# Altium schematic sheet Sh2_MCU.SchDoc
size A3
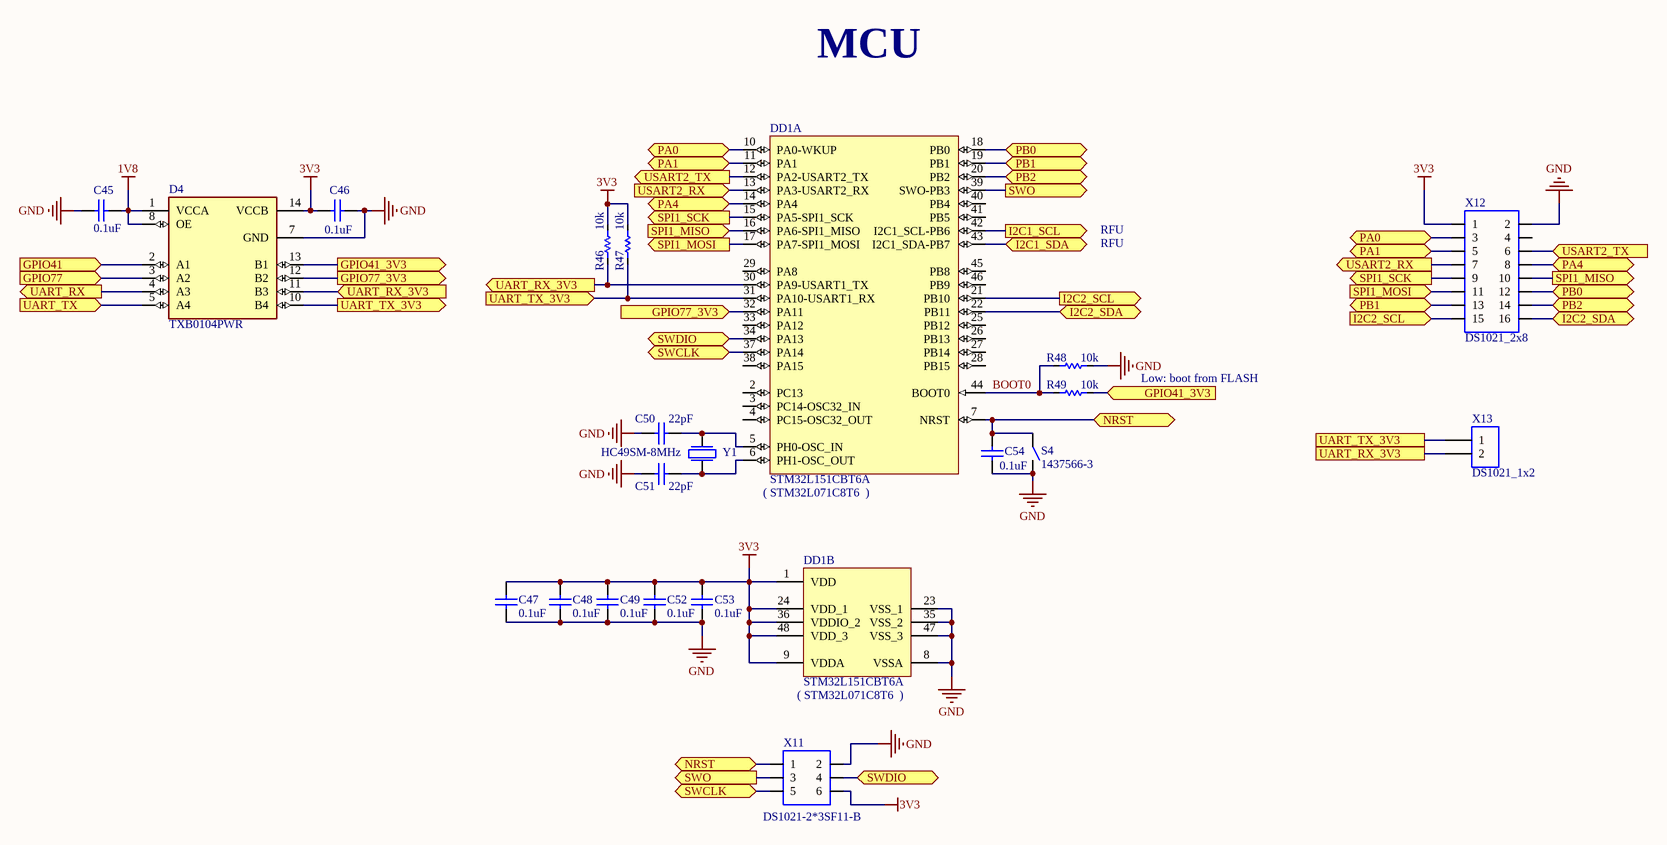
[diagram p0: Sh2_MCU.SchDoc]

## Parts
C45  0.1uF  [C_SMD0603]
C46  0.1uF  [C_SMD0603]
C47  0.1uF  [C_SMD0603]
C48  0.1uF  [C_SMD0603]
C49  0.1uF  [C_SMD0603]
C50  22pF  [C_SMD0603]
C51  22pF  [C_SMD0603]
C52  0.1uF  [C_SMD0603]
C53  0.1uF  [C_SMD0603]
C54  0.1uF  [C_SMD0603]
D4  TXB0104PWR  [SOP65P640X120-14N]
DD1  STM32L151CBT6A  [LQFP48_N]  (parts A,B of 2)
R46  10k  [R_SMD0603]
R47  10k  [R_SMD0603]
R48  10k  [R_SMD0603]
R49  10k  [R_SMD0603]
S4  1437566-3  [1437566-3]
X11  DS1021-2*3SF11-B  [PLD2-3]
X12  DS1021_2x8  [PLD2X8]
X13  DS1021_1x2  [PLD2]
Y1  HC49SM-8MHz  [HC49SM]

## Ports
GPIO41 (in), GPIO41_3V3 (in), GPIO41_3V3 (out), GPIO77 (in), GPIO77_3V3 (in), GPIO77_3V3 (out), I2C1_SCL (out), I2C1_SDA (bidir), I2C2_SCL (in), I2C2_SCL (out), I2C2_SDA (bidir), NRST (bidir), PA0 (bidir), PA1 (bidir), PA4 (bidir), PB0 (bidir), PB1 (bidir), PB2 (bidir), SPI1_MISO (in), SPI1_MISO (out), SPI1_MOSI (in), SPI1_MOSI (out), SPI1_SCK (out), SWCLK (bidir), SWDIO (bidir), SWO (out), UART_RX (out), UART_RX_3V3, UART_RX_3V3 (in), UART_RX_3V3 (out), UART_TX (in), UART_TX_3V3, UART_TX_3V3 (in), UART_TX_3V3 (out), USART2_RX (in), USART2_RX (out), USART2_TX (in), USART2_TX (out)

## Nets
1V8: C45.1 D4.1(VCCA) D4.8(OE)
3V3: C46.2 C47.1 C48.1 C49.1 C52.1 C53.1 D4.14(VCCB) DD1.1(VDD) DD1.9(VDDA) DD1.24(VDD_1) DD1.36(VDDIO_2) DD1.48(VDD_3) R46.1(CCW) R47.1(CCW) X11.6 X12.1
GND: C45.2 C46.1 C47.2 C48.2 C49.2 C50.1 C51.1 C52.2 C53.2 C54.2 D4.7(GND) DD1.8(VSSA) DD1.23(VSS_1) DD1.35(VSS_2) DD1.47(VSS_3) R48.2(CW) S4.2 X11.2 X12.2
BOOT0: DD1.44(BOOT0) R48.1(CCW) R49.1(CCW)
GPIO41: D4.2(A1) ; port GPIO41
GPIO41_3V3: D4.13(B1) R49.2(CW) ; port GPIO41_3V3
GPIO77: D4.3(A2) ; port GPIO77
GPIO77_3V3: D4.12(B2) DD1.32(PA11) ; port GPIO77_3V3
I2C1_SCL: DD1.42(I2C1_SCL-PB6) ; port I2C1_SCL
I2C1_SDA: DD1.43(I2C1_SDA-PB7) ; port I2C1_SDA
I2C2_SCL: DD1.21(PB10) X12.15 ; port I2C2_SCL
I2C2_SDA: DD1.22(PB11) X12.16 ; port I2C2_SDA
NRST: C54.1 DD1.7(NRST) S4.1 X11.1 ; port NRST
PA0: DD1.10(PA0-WKUP) X12.3 ; port PA0
PA1: DD1.11(PA1) X12.5 ; port PA1
PA4: DD1.14(PA4) X12.8 ; port PA4
PB0: DD1.18(PB0) X12.12 ; port PB0
PB1: DD1.19(PB1) X12.13 ; port PB1
PB2: DD1.20(PB2) X12.14 ; port PB2
SPI1_MISO: DD1.16(PA6-SPI1_MISO) X12.10 ; port SPI1_MISO
SPI1_MOSI: DD1.17(PA7-SPI1_MOSI) X12.11 ; port SPI1_MOSI
SPI1_SCK: DD1.15(PA5-SPI1_SCK) X12.9 ; port SPI1_SCK
SWCLK: DD1.37(PA14) X11.5 ; port SWCLK
SWDIO: DD1.34(PA13) X11.4 ; port SWDIO
SWO: DD1.39(SWO-PB3) X11.3 ; port SWO
UART_RX: D4.4(A3) ; port UART_RX
UART_RX_3V3: D4.11(B3) DD1.30(PA9-USART1_TX) R46.2(CW) X13.2 ; port UART_RX_3V3
UART_TX: D4.5(A4) ; port UART_TX
UART_TX_3V3: D4.10(B4) DD1.31(PA10-USART1_RX) R47.2(CW) X13.1 ; port UART_TX_3V3
USART2_RX: DD1.13(PA3-USART2_RX) X12.7 ; port USART2_RX
USART2_TX: DD1.12(PA2-USART2_TX) X12.6 ; port USART2_TX
NetC50_2: C50.2 DD1.5(PH0-OSC_IN) Y1.2
NetC51_2: C51.2 DD1.6(PH1-OSC_OUT) Y1.1

Not connected (* = marked no-connect by the designer): DD1 2(PC13) 3(PC14-OSC32_IN) 4(PC15-OSC32_OUT) 25(PB12) 26(PB13) 27(PB14) 28(PB15) 29(PA8) 33(PA12) 38(PA15) 40(PB4) 41(PB5) 45(PB8) 46(PB9); X12 4

## Notes on the sheet
- MCU
- RFU
- Low: boot from FLASH
- (near DD1) ( STM32L071C8T6  )
- Title
- Size:
- Date:
- A3
- Number:
- Time:
- Revision:
- Sheet
- of
- File:

## Library data of the parts
C45-C49 C52-C54 = C_SMD: GRM188R71H104KA93D; ComponentLink1Description: chipdip; ComponentLink1URL: https://www.chipdip.ru/product0/226236018; ComponentLink2Description: el; ComponentLink2URL: https://www.electronshik.ru/item/MUR/GRM188R71H104KA93D
C50 C51 = C_SMD: GRM1885C1H220JA01D; ComponentLink1Description: chipdip; ComponentLink1URL: https://www.chipdip.ru/product/grm1885c1h220j; ComponentLink2Description: el; ComponentLink2URL: https://www.electronshik.ru/item/MUR/GRM1885C1H220JA01D
D4 = TXB0104PWR: 4-Bit Bidirectional Voltage-Level Shifter with Auto Direction Sensing and +/-15 kV ESD Protect 14-TSSOP -40 to 85; MF: Texas Instruments; Availability: Unavailable; Texas_Instruments-Purchase-URL: https://snapeda.com/shop?store=Texas+Instruments&id=1077120; Package: TSSOP-14 Texas Instruments; MP: TXB0104PWR; SnapEDA_Link: https://www.snapeda.com/parts/TXB0104PWR/Texas%20Instruments/view-part/1077120/?ref=snap; Value: *; Price: None; ComponentLink1Description: elitan; ComponentLink1URL: https://www.elitan.ru/price/item703962
DD1 = STM32L151CBT6A: Analog - STM32L071C8T6 / Микроконтроллер 32-Бит, Cortex-M3, 32МГц, 128КБ Flash, LCD, USB, ADC, DAC [LQFP-48]; PartNumber: STM32F103C8T6; A/D Converter: 2x12-bit (10 Channel); Core: ARM Cortex-M3; FLASH Size (Prog) (kB): 64; I/Os (High Current): 37; Internal RAM Size (kB): 20; Operating Frequency(F) (Processor speed) (MHz): 72; Packing: Tray; Supply Voltage(Vcc) min (V): 2; DatasheetVersion: Rev. 16; PackageVersion: Rev. 6, 06/2013; PackageReference: LQFP48; PackageDescription: 48-Pin Low Profile Quad Flat Package, 7 x 7 mm Body, 0.5 mm Pitch; Supplier 1: Digi-Key; Supplier Part Number 1: 497-6063-ND; Supplier 2: Farnell; Supplier Part Number 2: 1447637; Supplier 3: Newark; Supplier Part Number 3: 59M2182; Supplier 4: Newark; Supplier Part Number 4: 57P1222; Supplier 5: Mouser; Supplier Part Number 5: 511-STM32F103C8T6; Mounting Technology: Surface Mount; ComponentLink1Description: elitan; ComponentLink1URL: https://www.elitan.ru/price/item11268663; ComponentLink2Description: chipdip; ComponentLink2URL: https://www.chipdip.ru/product/stm32l151cbt6a-2
R46-R49 = R_SMD: RC0603FR-0710KL (CRCW060310K0FKEA); ComponentLink1Description: chipdip; ComponentLink1URL: https://www.chipdip.ru/product0/9000079736; ComponentLink2Description: el; ComponentLink2URL: https://www.electronshik.ru/item/VISHAY/CRCW060310K0FKEA
S4 = 1437566-3: SMD button; ComponentLink1Description: chipdip; ComponentLink1URL: https://www.chipdip.ru/product/tyco-1437566-3-fsmsm?from=suggest_product; ComponentLink2Description: elitan; ComponentLink2URL: https://www.elitan.ru/price/item565583
X11 = DS1021_2x3: Вилка штыревая 2.54мм 2x3 прямая тип1; ComponentLink1Description: chipdip; ComponentLink1URL: https://www.chipdip.ru/product/pld-6; ComponentLink2Description: electronshik; ComponentLink2URL: https://www.electronshik.ru/item/CONNFLY/DS1021-2x3SF11-B
X12 = DS1021_2x8: Вилка штыревая 2.54мм 2х8 прямая PLD-16; ComponentLink1Description: chipdip; ComponentLink1URL: https://www.chipdip.ru/product/pld-16; ComponentLink2Description: elitan; ComponentLink2URL: https://www.elitan.ru/price/item14835380
X13 = DS1021_1x2: Вилка штыревая 2.54мм 1x2 прямая PLS-2; ComponentLink1Description: chipdip; ComponentLink1URL: https://www.chipdip.ru/product/pls-2; ComponentLink2Description: elitan; ComponentLink2URL: https://www.elitan.ru/price/item10669650
Y1 = HC49SM: 8 MHz resonator; ComponentLink1Description: 8MHz-chipdip; ComponentLink1URL: https://www.chipdip.ru/product/8mhz-hc-49sm; ComponentLink2Description: 8MHz-elitan; ComponentLink2URL: https://www.elitan.ru/price/item2093968